# EAGLE schematic hammer-of-blues (EAGLE 9.7.0)
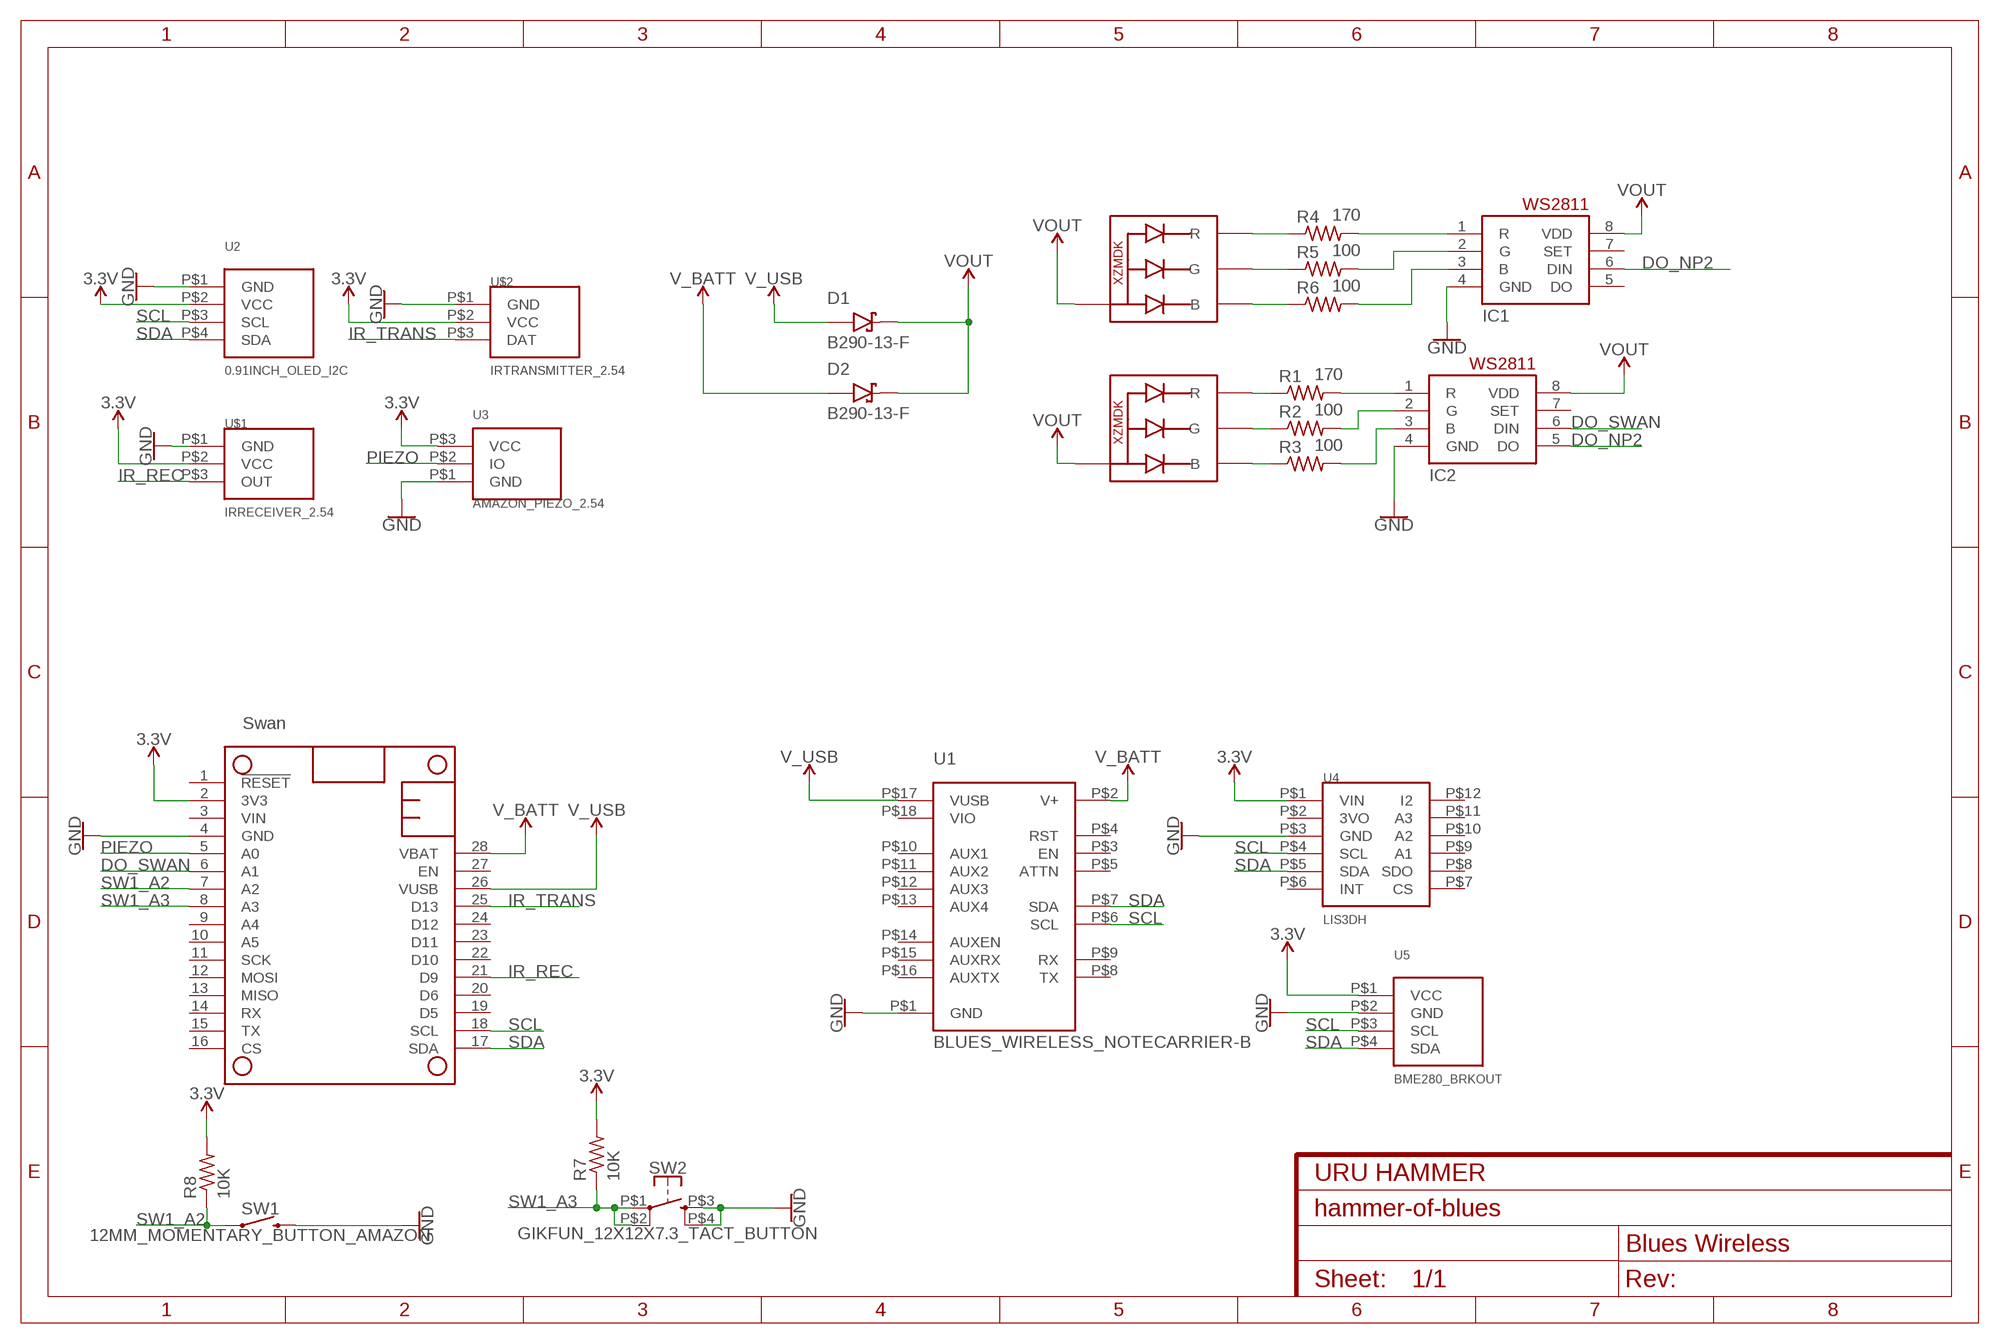
[diagram p0: schematic, sheet 1]
FRAME1 (FRAME-A4L): CNAME: URU HAMMER; DESIGNER: Blues Wireless

## Parts
D1  B290-13-F  [DIOM4336X250N]
D2  B290-13-F  [DIOM4336X250N]
IC1  WS2811-SOP8  [SO08-SKINNYPADS]
IC2  WS2811-SOP8  [SO08-SKINNYPADS]
LED1  XZMDKCBDDG45S-9  [XZMDKCBDDG45S-9]
LED2  XZMDKCBDDG45S-9  [XZMDKCBDDG45S-9]
MOD1  BLUES_WIRELESS_SWAN_2.54BLUES_WIRELESS_SWAN_2.54_HEADERS  [BLUES_WIRELESS_SWAN_2.54_HEADERS]
R1  170  R-US_R0805  [R0805]
R2  100  R-US_R0805  [R0805]
R3  100  R-US_R0805  [R0805]
R4  170  R-US_R0805  [R0805]
R5  100  R-US_R0805  [R0805]
R6  100  R-US_R0805  [R0805]
R7  10K  R-US_R0805  [R0805]
R8  10K  R-US_R0805  [R0805]
SW1  12MM_MOMENTARY_BUTTON_AMAZON  [12MM_MOMENTARY_BUTTON_AMAZON]
SW2  GIKFUN_12X12X7.3_TACT_BUTTON  [GIKFUN_12X12X7.3_TACT_BUTTON]
U1  BLUES_WIRELESS_NOTECARRIER-B  [BLUES_WIRELESS_NOTECARRIER-B]
U2  0.91INCH_OLED_I2C  [0.91INCH_OLED_I2C]
U3  AMAZON_PIEZO_2.54  [AMAZON_PIEZO_2.54]
U4  LIS3DH  [LIS3DH_QWIIC]
U5  BME280_BRKOUT  [BME280_BRKOUT]
U$1  IRRECEIVER_2.54  [IRRECEIVER_2.54]
U$2  IRTRANSMITTER_2.54  [IRTRANSMITTER_2.54]

## Nets
3.3V: MOD1.2(3V3) R7.2 R8.2 U2.P$2(VCC) U3.P$3(VCC) U4.P$1(VIN) U5.P$1(VCC) U$1.P$2(VCC) U$2.P$2(VCC)
DO_NP2: IC1.6(DIN) IC2.5(DO)
DO_SWAN: IC2.6(DIN) MOD1.6(A1)
GND: IC1.4(GND) IC2.4(GND) MOD1.4(GND) SW1.P$2 SW2.P$3 SW2.P$4 U1.P$1(GND) U2.P$1(GND) U3.P$1(GND) U4.P$3(GND) U5.P$2(GND) U$1.P$1(GND) U$2.P$1(GND)
IR_REC: MOD1.21(D9) U$1.P$3(OUT)
IR_TRANS: MOD1.25(D13) U$2.P$3(DAT)
N$1: LED1.P$1(R) R1.1
N$2: LED1.P$4(G) R2.1
N$3: LED1.P$3(B) R3.1
N$4: IC2.1(R) R1.2
N$5: IC2.2(G) R2.2
N$6: IC2.3(B) R3.2
N$7: IC1.1(R) R4.2
N$8: IC1.2(G) R5.2
N$9: IC1.3(B) R6.2
N$10: LED2.P$1(R) R4.1
N$11: LED2.P$4(G) R5.1
N$12: LED2.P$3(B) R6.1
PIEZO: MOD1.5(A0) U3.P$2(IO)
SCL: MOD1.18(SCL) U1.P$6(SCL) U2.P$3(SCL) U4.P$4(SCL) U5.P$3(SCL)
SDA: MOD1.17(SDA) U1.P$7(SDA) U2.P$4(SDA) U4.P$5(SDA) U5.P$4(SDA)
SW1_A2: MOD1.7(A2) R8.1 SW1.P$1
SW1_A3: MOD1.8(A3) R7.1 SW2.P$1 SW2.P$2
V_BATT: D2.A MOD1.28(VBAT) U1.P$2(V+)
V_USB: D1.A MOD1.26(VUSB) U1.P$17(VUSB)
VOUT: D1.C(K) D2.C(K) IC1.8(VDD) IC2.8(VDD) LED1.P$2(VDD) LED2.P$2(VDD)
Unconnected: IC1.5(DO) IC1.7(SET) IC2.7(SET) MOD1.1(!RESET) MOD1.9(A4) MOD1.10(A5) MOD1.11(SCK) MOD1.12(MOSI) MOD1.13(MISO) MOD1.14(RX) MOD1.15(TX) MOD1.16(CS) MOD1.19(D5) MOD1.20(D6) MOD1.22(D10) MOD1.23(D11) MOD1.24(D12) MOD1.27(EN) U1.P$3(EN) U1.P$4(RST) U1.P$5(ATTN) U1.P$8(TX) U1.P$9(RX) U1.P$10(AUX1) U1.P$11(AUX2) U1.P$12(AUX3) U1.P$13(AUX4) U1.P$14(AUXEN) U1.P$15(AUXRX) U1.P$16(AUXTX) U1.P$18(VIO) U4.P$2(3VO) U4.P$6(INT) U4.P$7(CS) U4.P$8(SDO) U4.P$9(A1) U4.P$10(A2) U4.P$11(A3) U4.P$12(I2)

## Notes on the sheet
- Swan

## Power pins joined to a net without a drawn wire
VIN: MOD1.3(VIN)

## Library data of the parts
D1 D2 = B290-13-F:B290-13-F: B290 series 90 V 2 A High Voltage Schottky Barrier Rectifier - DO-214AA, SMB Check availability <https://pricing.snapeda.com/parts/B290-13-F/Diodes%20Inc./view-part?ref=eda>; AVAILABILITY: In Stock; DESCRIPTION: Diode Schottky 90 V 2A Surface Mount SMB; MF: Diodes Inc.; MP: B290-13-F; PACKAGE: DO-214 Diodes Inc.; PRICE: None; PURCHASE-URL: https://pricing.snapeda.com/search/part/B290-13-F/?ref=eda
IC1 IC2 = adafruit:WS2811
LED1 LED2 = uru:XZMDKCBDDG45S-9
MOD1 = Blues Wireless:BLUES_WIRELESS_SWAN_2.54: Blues Wireless Swan Swan is a low-cost, embeddable STM32L4-based microcontroller designed to accelerate the development and deployment of battery-powered IoT solutions. It is especially useful for applications requiring large memory or a high degree of I/O expandability at an affordable cost, such as edge inferencing and remote monitoring. Uniquely for Feather-compatible boards, we designed Swan to satisfy developers’ needs spanning from early prototyping to high-volume deployment. Developers can use Swan in conjunction with Adafruit’s myriad sensors and FeatherWing-compatible carriers. Due to its novel design, for high-volume deployment the low-cost Swan can also be soldered directly to a parent PCB integrating those sensors, utilizing the full range of Swan’s I/O capabilities. Swan Datasheet <https://dev.blues.io/hardware/swan-datasheet/> Purchase Blues Wireless Products Swan <https://shop.blues.io/products/swan>
R1-R8 = adafruit:R-US_: RESISTOR, American symbol
SW1 = uru:12MM_MOMENTARY_BUTTON_AMAZON
SW2 = uru:GIKFUN_12X12X7.3_TACT_BUTTON
U1 = Blues Wireless:BLUES_WIRELESS_NOTECARRIER-B
U2 = uru:0.91INCH_OLED_I2C
U3 = uru:AMAZON_PIEZO_2.54
U4 = uru:LIS3DH
U5 = uru:BME280_BRKOUT
U$1 = uru:IRRECEIVER_2.54
U$2 = uru:IRTRANSMITTER_2.54